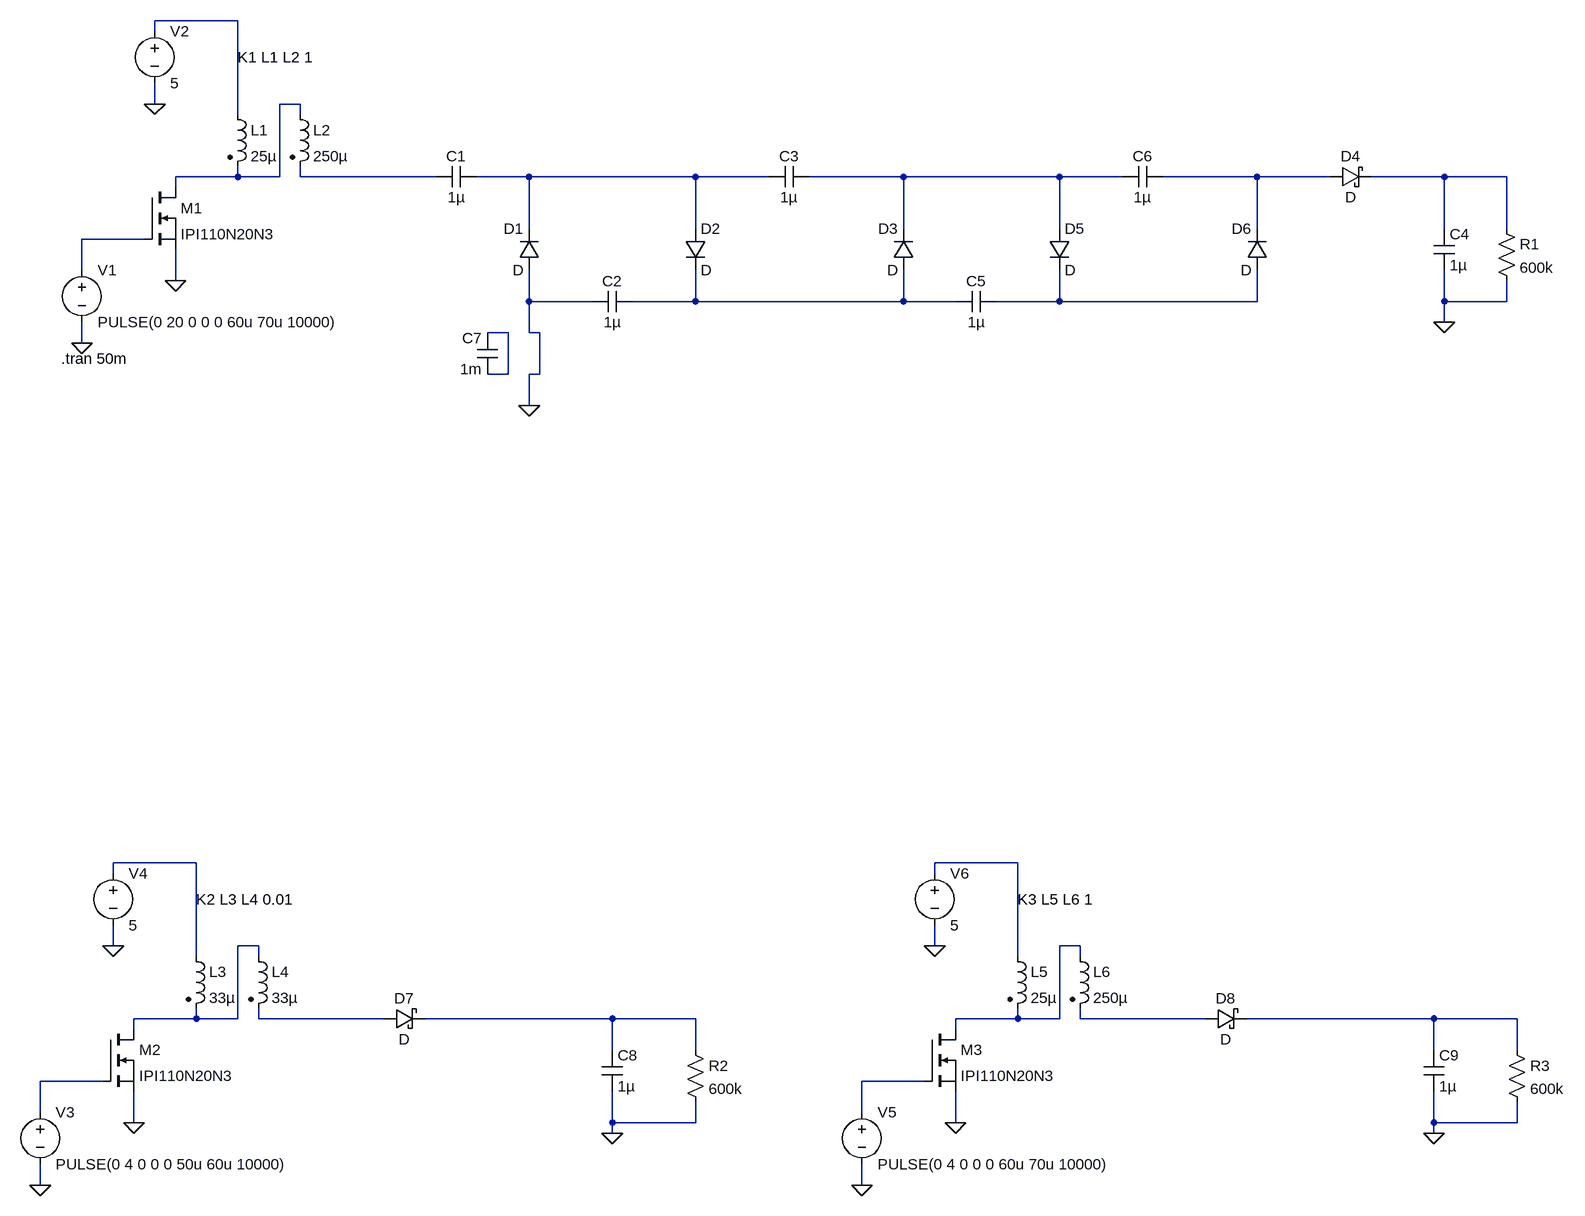
[diagram p0: schematic Generic_boost.asc]
Generic_boost.asc, the LTspice schematic file:
Version 4
SHEET 1 2416 1764
WIRE 272 -48 144 -48
WIRE 144 -32 144 -48
WIRE 144 80 144 48
WIRE 368 80 336 80
WIRE 272 96 272 -48
WIRE 368 96 368 80
WIRE 272 192 272 176
WIRE 272 192 176 192
WIRE 336 192 336 80
WIRE 336 192 272 192
WIRE 368 192 368 176
WIRE 576 192 368 192
WIRE 720 192 640 192
WIRE 976 192 720 192
WIRE 1088 192 976 192
WIRE 1296 192 1152 192
WIRE 1536 192 1296 192
WIRE 1632 192 1536 192
WIRE 1840 192 1696 192
WIRE 1952 192 1840 192
WIRE 2128 192 2016 192
WIRE 2224 192 2128 192
WIRE 176 208 176 192
WIRE 720 272 720 192
WIRE 976 272 976 192
WIRE 1296 272 1296 192
WIRE 1536 272 1536 192
WIRE 1840 272 1840 192
WIRE 2128 272 2128 192
WIRE 2224 272 2224 192
WIRE 128 288 32 288
WIRE 32 336 32 288
WIRE 176 352 176 304
WIRE 720 384 720 336
WIRE 816 384 720 384
WIRE 976 384 976 336
WIRE 976 384 880 384
WIRE 1296 384 1296 336
WIRE 1296 384 976 384
WIRE 1376 384 1296 384
WIRE 1536 384 1536 336
WIRE 1536 384 1440 384
WIRE 1840 384 1840 336
WIRE 1840 384 1536 384
WIRE 2128 384 2128 336
WIRE 2224 384 2224 352
WIRE 2224 384 2128 384
WIRE 2128 416 2128 384
WIRE 688 432 656 432
WIRE 720 432 720 384
WIRE 736 432 720 432
WIRE 32 448 32 416
WIRE 688 496 688 432
WIRE 688 496 656 496
WIRE 736 496 736 432
WIRE 736 496 720 496
WIRE 720 544 720 496
WIRE 208 1248 80 1248
WIRE 1472 1248 1344 1248
WIRE 80 1264 80 1248
WIRE 1344 1264 1344 1248
WIRE 80 1376 80 1344
WIRE 304 1376 272 1376
WIRE 1344 1376 1344 1344
WIRE 1568 1376 1536 1376
WIRE 208 1392 208 1248
WIRE 304 1392 304 1376
WIRE 1472 1392 1472 1248
WIRE 1568 1392 1568 1376
WIRE 208 1488 208 1472
WIRE 208 1488 112 1488
WIRE 272 1488 272 1376
WIRE 272 1488 208 1488
WIRE 304 1488 304 1472
WIRE 496 1488 304 1488
WIRE 848 1488 560 1488
WIRE 976 1488 848 1488
WIRE 1472 1488 1472 1472
WIRE 1472 1488 1376 1488
WIRE 1536 1488 1536 1376
WIRE 1536 1488 1472 1488
WIRE 1568 1488 1568 1472
WIRE 1760 1488 1568 1488
WIRE 2112 1488 1824 1488
WIRE 2240 1488 2112 1488
WIRE 112 1504 112 1488
WIRE 1376 1504 1376 1488
WIRE 848 1536 848 1488
WIRE 976 1536 976 1488
WIRE 2112 1536 2112 1488
WIRE 2240 1536 2240 1488
WIRE 64 1584 -32 1584
WIRE 1328 1584 1232 1584
WIRE -32 1632 -32 1584
WIRE 1232 1632 1232 1584
WIRE 112 1648 112 1600
WIRE 848 1648 848 1600
WIRE 976 1648 976 1616
WIRE 976 1648 848 1648
WIRE 1376 1648 1376 1600
WIRE 2112 1648 2112 1600
WIRE 2240 1648 2240 1616
WIRE 2240 1648 2112 1648
WIRE 848 1664 848 1648
WIRE 2112 1664 2112 1648
WIRE -32 1744 -32 1712
WIRE 1232 1744 1232 1712
FLAG 176 352 0
FLAG 32 448 0
FLAG 144 80 0
FLAG 2128 416 0
FLAG 720 544 0
FLAG 112 1648 0
FLAG -32 1744 0
FLAG 80 1376 0
FLAG 848 1664 0
FLAG 1376 1648 0
FLAG 1232 1744 0
FLAG 1344 1376 0
FLAG 2112 1664 0
SYMBOL ind2 256 80 R0
SYMATTR InstName L1
SYMATTR Value 25µ
SYMATTR Type ind
SYMATTR SpiceLine Rser=.74
SYMBOL ind2 352 80 R0
SYMATTR InstName L2
SYMATTR Value 250µ
SYMATTR Type ind
SYMATTR SpiceLine Rser=13.7
SYMBOL nmos 128 208 R0
SYMATTR InstName M1
SYMATTR Value IPI110N20N3
SYMBOL voltage 32 320 R0
WINDOW 123 0 0 Left 0
WINDOW 39 0 0 Left 0
SYMATTR InstName V1
SYMATTR Value PULSE(0 20 0 0 0 60u 70u 10000)
SYMBOL voltage 144 -48 R0
WINDOW 123 0 0 Left 0
WINDOW 39 0 0 Left 0
SYMATTR InstName V2
SYMATTR Value 5
SYMBOL cap 640 176 R90
WINDOW 0 0 32 VBottom 2
WINDOW 3 32 32 VTop 2
SYMATTR InstName C1
SYMATTR Value 1µ
SYMBOL diode 736 336 R180
WINDOW 0 24 64 Left 2
WINDOW 3 24 0 Left 2
SYMATTR InstName D1
SYMBOL cap 880 368 R90
WINDOW 0 0 32 VBottom 2
WINDOW 3 32 32 VTop 2
SYMATTR InstName C2
SYMATTR Value 1µ
SYMBOL diode 960 272 R0
SYMATTR InstName D2
SYMBOL cap 1152 176 R90
WINDOW 0 0 32 VBottom 2
WINDOW 3 32 32 VTop 2
SYMATTR InstName C3
SYMATTR Value 1µ
SYMBOL diode 1312 336 R180
WINDOW 0 24 64 Left 2
WINDOW 3 24 0 Left 2
SYMATTR InstName D3
SYMBOL schottky 1952 208 R270
WINDOW 0 32 32 VTop 2
WINDOW 3 0 32 VBottom 2
SYMATTR InstName D4
SYMBOL cap 1440 368 R90
WINDOW 0 0 32 VBottom 2
WINDOW 3 32 32 VTop 2
SYMATTR InstName C5
SYMATTR Value 1µ
SYMBOL diode 1520 272 R0
SYMATTR InstName D5
SYMBOL cap 1696 176 R90
WINDOW 0 0 32 VBottom 2
WINDOW 3 32 32 VTop 2
SYMATTR InstName C6
SYMATTR Value 1µ
SYMBOL diode 1856 336 R180
WINDOW 0 24 64 Left 2
WINDOW 3 24 0 Left 2
SYMATTR InstName D6
SYMBOL cap 672 496 R180
WINDOW 0 24 56 Left 2
WINDOW 3 24 8 Left 2
SYMATTR InstName C7
SYMATTR Value 1m
SYMBOL cap 2112 272 R0
SYMATTR InstName C4
SYMATTR Value 1µ
SYMBOL res 2208 256 R0
SYMATTR InstName R1
SYMATTR Value 600k
SYMBOL ind2 192 1376 R0
SYMATTR InstName L3
SYMATTR Value 33µ
SYMATTR Type ind
SYMATTR SpiceLine Ipk=3 Rser=.136
SYMBOL ind2 288 1376 R0
SYMATTR InstName L4
SYMATTR Value 33µ
SYMATTR Type ind
SYMATTR SpiceLine Ipk=3 Rser=.136
SYMBOL nmos 64 1504 R0
SYMATTR InstName M2
SYMATTR Value IPI110N20N3
SYMBOL voltage -32 1616 R0
WINDOW 123 0 0 Left 0
WINDOW 39 0 0 Left 0
SYMATTR InstName V3
SYMATTR Value PULSE(0 4 0 0 0 50u 60u 10000)
SYMBOL voltage 80 1248 R0
WINDOW 123 0 0 Left 0
WINDOW 39 0 0 Left 0
SYMATTR InstName V4
SYMATTR Value 5
SYMBOL schottky 496 1504 R270
WINDOW 0 32 32 VTop 2
WINDOW 3 0 32 VBottom 2
SYMATTR InstName D7
SYMBOL cap 832 1536 R0
SYMATTR InstName C8
SYMATTR Value 1µ
SYMBOL res 960 1520 R0
SYMATTR InstName R2
SYMATTR Value 600k
SYMBOL ind2 1456 1376 R0
SYMATTR InstName L5
SYMATTR Value 25µ
SYMATTR Type ind
SYMATTR SpiceLine Ipk=1.3 Rser=.74
SYMBOL ind2 1552 1376 R0
SYMATTR InstName L6
SYMATTR Value 250µ
SYMATTR Type ind
SYMATTR SpiceLine Rser=13.7
SYMBOL nmos 1328 1504 R0
SYMATTR InstName M3
SYMATTR Value IPI110N20N3
SYMBOL voltage 1232 1616 R0
WINDOW 123 0 0 Left 0
WINDOW 39 0 0 Left 0
SYMATTR InstName V5
SYMATTR Value PULSE(0 4 0 0 0 60u 70u 10000)
SYMBOL voltage 1344 1248 R0
WINDOW 123 0 0 Left 0
WINDOW 39 0 0 Left 0
SYMATTR InstName V6
SYMATTR Value 5
SYMBOL schottky 1760 1504 R270
WINDOW 0 32 32 VTop 2
WINDOW 3 0 32 VBottom 2
SYMATTR InstName D8
SYMBOL cap 2096 1536 R0
SYMATTR InstName C9
SYMATTR Value 1µ
SYMBOL res 2224 1520 R0
SYMATTR InstName R3
SYMATTR Value 600k
TEXT 272 8 Left 2 !K1 L1 L2 1
TEXT 0 472 Left 2 !.tran 50m
TEXT 208 1304 Left 2 !K2 L3 L4 0.01
TEXT 1472 1304 Left 2 !K3 L5 L6 1

The netlist it stands for:
* Generic_boost.asc
L1 N001 N002 25µ Rser=.74
L2 N002 N003 250µ Rser=13.7
M1 N002 N008 0 0 IPI110N20N3
V1 N008 0 PULSE(0 20 0 0 0 60u 70u 10000)
V2 N001 0 5
C1 N004 N003 1µ
D1 0 N004 D
C2 N009 0 1µ
D2 N004 N009 D
C3 N005 N004 1µ
D3 N009 N005 D
D4 N006 N007 D
C5 N010 N009 1µ
D5 N005 N010 D
C6 N006 N005 1µ
D6 N010 N006 D
C7 N011 N011 1m
C4 N007 0 1µ
R1 N007 0 600k
L3 N012 N014 33µ Ipk=3 Rser=.136
L4 N014 N016 33µ Ipk=3 Rser=.136
M2 N014 N020 0 0 IPI110N20N3
V3 N020 0 PULSE(0 4 0 0 0 50u 60u 10000)
V4 N012 0 5
D7 N016 N017 D
C8 N017 0 1µ
R2 N017 0 600k
L5 N013 N015 25µ Ipk=1.3 Rser=.74
L6 N015 N018 250µ Rser=13.7
M3 N015 N021 0 0 IPI110N20N3
V5 N021 0 PULSE(0 4 0 0 0 60u 70u 10000)
V6 N013 0 5
D8 N018 N019 D
C9 N019 0 1µ
R3 N019 0 600k
.model D D
.lib standard.dio
.model NMOS NMOS
.model PMOS PMOS
.lib standard.mos
K1 L1 L2 1
.tran 50m
K2 L3 L4 0.01
K3 L5 L6 1
.backanno
.end